# EAGLE design power_pcb (EAGLE 9.0.0)
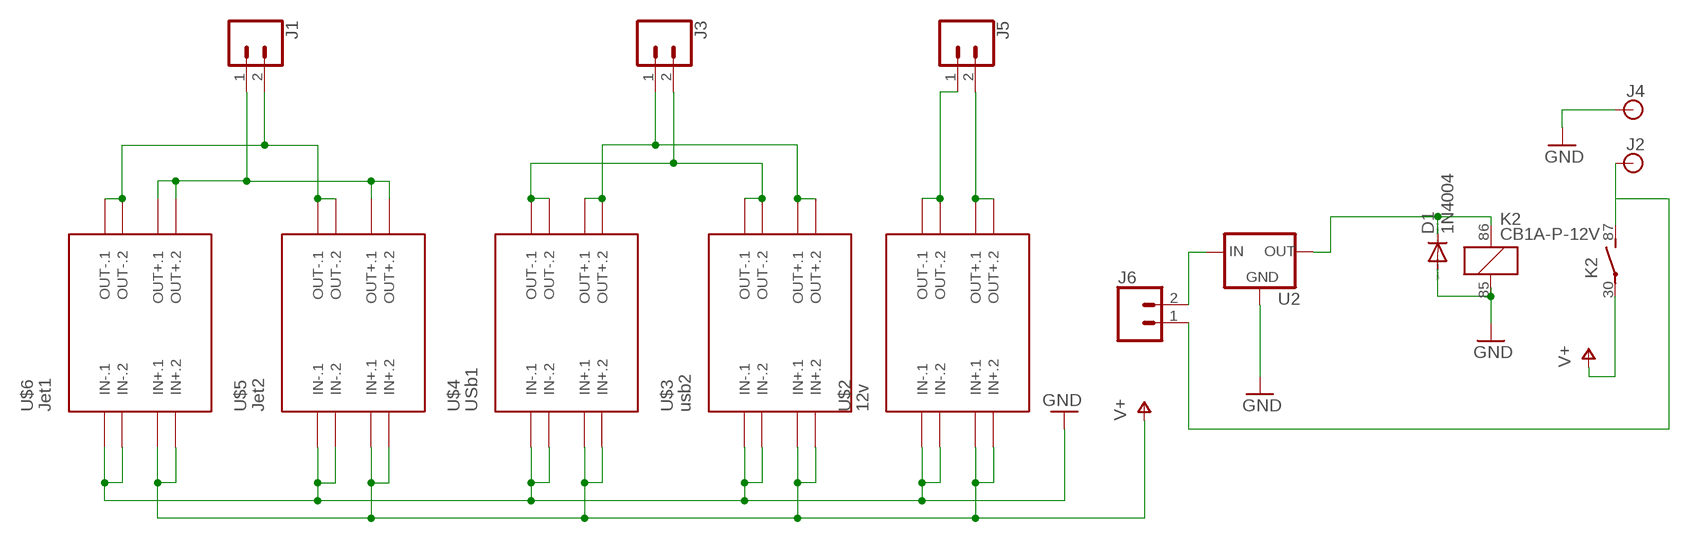
[diagram p0: schematic, sheet 1]

## Parts
D1  1N4004  [DO41-10]
J1  CONN_025MM  [SCREWTERMINAL-5MM-2]
J2  BANANA_CONN  [BANANA_CONN]
J3  CONN_025MM  [SCREWTERMINAL-5MM-2]
J4  BANANA_CONN  [BANANA_CONN]
J5  CONN_025MM  [SCREWTERMINAL-5MM-2]
J6  CONN_025MM  [SCREWTERMINAL-5MM-2]
K2  CB1A-P-12V  [CB1]
U2  V_REG_78XXSINK  [TO220-IGO]
U$2  12v  DC-DC-STEP-DOWN-MP1584  [DC-DC-STEP-DOWN-MP1584]
U$3  usb2  DC-DC-STEP-DOWN-MP1584  [DC-DC-STEP-DOWN-MP1584]
U$4  USb1  DC-DC-STEP-DOWN-MP1584  [DC-DC-STEP-DOWN-MP1584]
U$5  Jet2  DC-DC-STEP-DOWN-MP1584  [DC-DC-STEP-DOWN-MP1584]
U$6  Jet1  DC-DC-STEP-DOWN-MP1584  [DC-DC-STEP-DOWN-MP1584]

## Nets
GND: D1.A J4.P$1 K2.85 U2.GND U$2.IN-.1 U$2.IN-.2 U$3.IN-.1 U$3.IN-.2 U$4.IN-.1 U$4.IN-.2 U$5.IN-.1 U$5.IN-.2 U$6.IN-.1 U$6.IN-.2
N$2: J2.P$1 J6.1 K2.87(2:S)
N$4: J1.1 U$5.OUT+.1 U$5.OUT+.2 U$6.OUT+.1 U$6.OUT+.2
N$5: J1.2 U$5.OUT-.1 U$5.OUT-.2 U$6.OUT-.1 U$6.OUT-.2
N$6: J3.2 U$3.OUT-.1 U$3.OUT-.2 U$4.OUT-.1 U$4.OUT-.2
N$7: J3.1 U$3.OUT+.1 U$3.OUT+.2 U$4.OUT+.1 U$4.OUT+.2
N$8: J5.1 U$2.OUT-.1 U$2.OUT-.2
N$9: J5.2 U$2.OUT+.1 U$2.OUT+.2
N$11: D1.C K2.86 U2.OUT
N$13: J6.2 U2.IN
V+: K2.30(2:P) U$2.IN+.1 U$2.IN+.2 U$3.IN+.1 U$3.IN+.2 U$4.IN+.1 U$4.IN+.2 U$5.IN+.1 U$5.IN+.2 U$6.IN+.1 U$6.IN+.2

## Library data of the parts
D1 = diode:1N4004: DIODE general purpose rectifier, 1 A
J1 J3 J5 J6 = SparkFun-Connectors:CONN_02: Multi connection point. Often used as Generic Header-pin footprint for 0.1 inch spaced/style header connections On any of the 0.1 inch spaced packages, you can populate with these: Break Away Headers - Straight <https://www.sparkfun.com/products/116> (PRT-00116) Break Away Male Headers - Right Angle <https://www.sparkfun.com/products/553> (PRT-00553) Female Headers <https://www.sparkfun.com/products/115> (PRT-00115) Break Away Headers - Machine Pin <https://www.sparkfun.com/products/117> (PRT-00117) Break Away Female Headers - Swiss Machine Pin <https://www.sparkfun.com/products/743> (PRT-00743) For SCREWTERMINALS and SPRING TERMINALS visit here: Screw Terimnals on SparkFun.com <https://www.sparkfun.com/search/results?term=Screw+Terminals> (5mm/3.5mm/2.54mm spacing) This device is also useful as a general connection point to wire up your design to another part of your project. Our various solder wires solder well into these plated through hole pads. Hook-Up Wire - Assortment (Stranded, 22 AWG) <https://www.sparkfun.com/products/11375> (PRT-11375) Hook-Up Wire - Assortment (Solid Core, 22 AWG) <https://www.sparkfun.com/products/11367> (PRT-11367) View the entire wire category on our website here <https://www.sparkfun.com/categories/141> Special notes: Molex polarized connector foot print use with: PRT-08233 with associated crimp pins and housings. 2.54_SCREWTERM for use with PRT-10571. 3.5mm Screw Terminal footprints for PRT-08084 5mm Screw Terminal footprints for use with PRT-08432; SF_SKU: PRT-08432
J2 J4 = SparkFun-Connectors:BANANA_CONN: Through-hole Banana Jack Basic PTH connection for banana jack plugs SparkFun Products: Multimeter Kit <https://www.sparkfun.com/products/retired/10956> Banana to Alligator Cable <https://www.sparkfun.com/products/retired/509> Banana to Alligator Coax Cable <https://www.sparkfun.com/products/retired/508> Banana to Banana Cable <https://www.sparkfun.com/products/retired/507> Banana to IC Hook Cables <https://www.sparkfun.com/products/retired/506>
K2 = relay:CB*: HIGH POWER AUTOMOTIVE RELAY Form A NAiS Source: http://www.mew-europe.com/.. en_ds_61202_0000.pdf; MF: AROMAT/ MATSUSHITA; MPN: CB1A-P-12V; OC_FARNELL: 1270582; OC_NEWARK: 50B849
U2 = SparkFun-IC-Power:V_REG_78XX: Voltage Regulator Standard 78xx regulator. IGO (Input Ground Output). Spark Fun Electronics SKU : COM-00107
U$2-U$6 = diy-modules:DC-DC-STEP-DOWN-MP1584: DC/DC Step-Down Regulator based on MP1584 chip MP1584 datasheet available here: http://www.haoyuelectronics.com/Attachment/MP1584/MP1584.pdf Click here to find device on ebay.com <http://www.ebay.com/sch/mp1584+module>

## Board
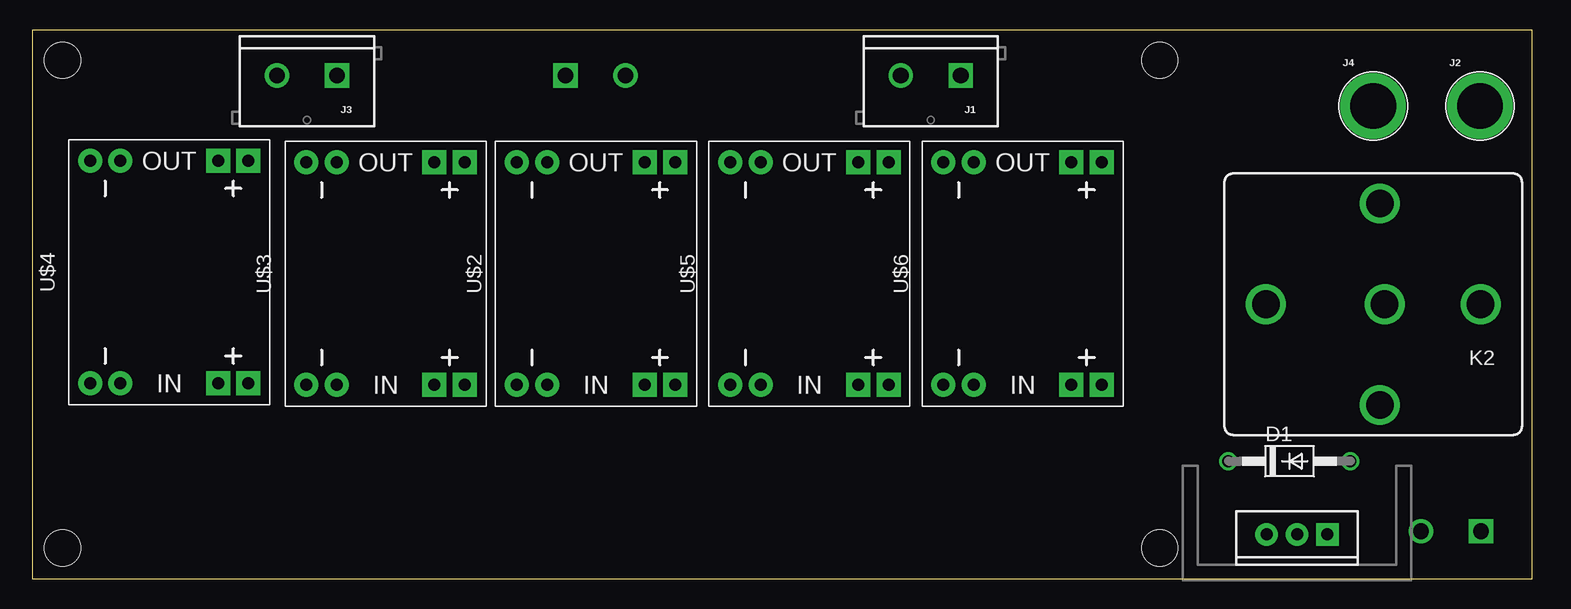
[diagram p1: board, top side]
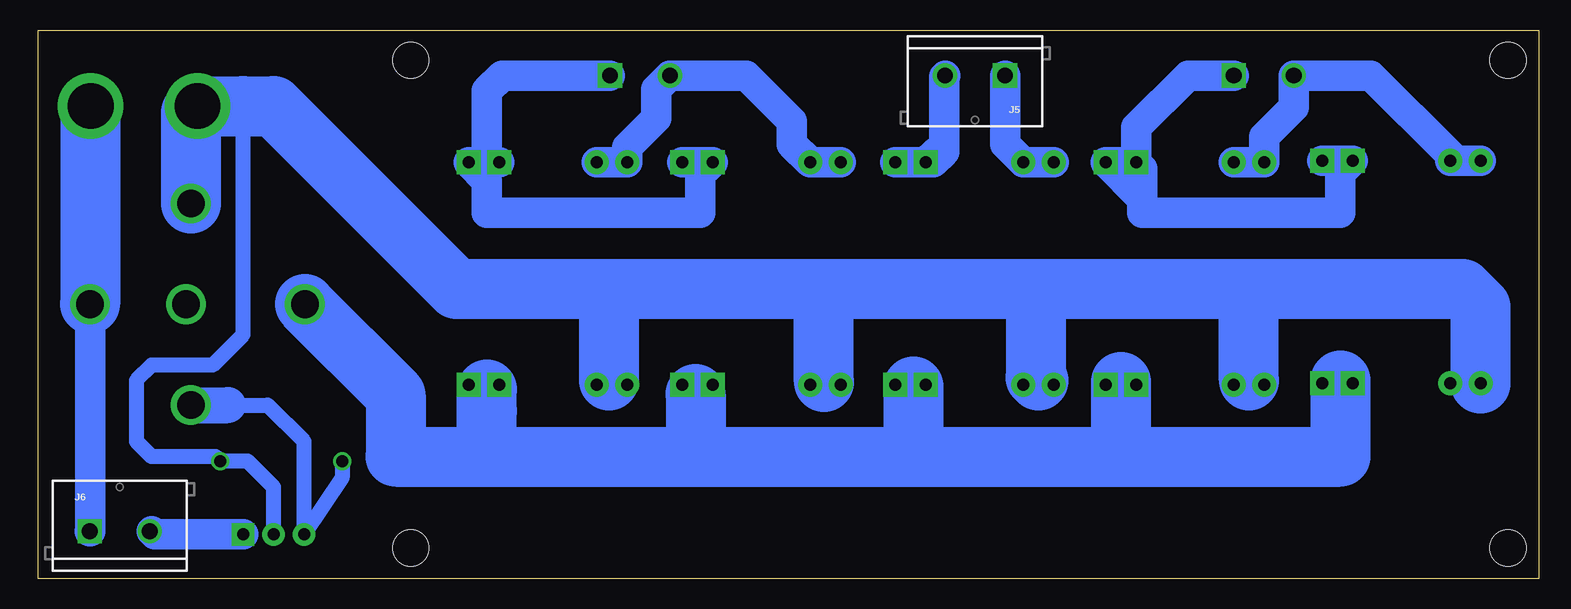
[diagram p2: board, bottom side, seen from below]

Size 125.02 x 45.71 mm. Coordinates in mm from the lower left corner, seen from the top.
Outline: 0,0 125.02,0 125.02,45.71 0,45.71 0,0
Copper layers (1*16): Top 0.035mm / dielectric 1.5mm / Bottom 0.035mm
Design rules "default": minimum track width 6mil, minimum drill 0.35mm, track to track 6mil, track to pad 6mil, pad to pad 6mil, via to via 6mil, smd to smd 6mil, copper to edge 40mil, drill to drill 6mil, minimum pad ring 10mil, minimum via ring 8mil, stop-mask expansion 4mil, vias tented up to drill 0mil, thermal gap 10mil
Holes 3 mm at 2.54,43.18 2.54,2.54 93.98,2.54 93.98,43.18

### Footprints (pad centres in the part's own frame; a part is rotated, then mirrored left to right if it is on the bottom)
DO41-10 = drill 1: A 5.08,0; C -5.08,0
SCREWTERMINAL-5MM-2 = drill 1.3 pad 2.032 square: 1 0,0 | drill 1.3 pad 2.032: 2 5,0
BANANA_CONN = drill 3.81 pad 5.461: P$1 0,0
CB1 = drill 2.3: 30 8.95,0; 85 -0.55,-8.4; 86 -0.55,8.4; 87 -8.95,0; 87A -0.95,0
TO220-IGO = drill 1 pad 1.88: GND 0,0; OUT 2.54,0 | drill 1 pad 1.88 square: IN -2.54,0
DC-DC-STEP-DOWN-MP1584 = drill 1 pad 2 square: IN+.1 -9.271,-4.064; IN+.2 -9.271,-6.604; OUT+.1 9.271,-4.064; OUT+.2 9.271,-6.604 | drill 1 pad 2: IN-.1 -9.271,6.604; IN-.2 -9.271,4.064; OUT-.1 9.271,6.604; OUT-.2 9.271,4.064

### Placement (x,y rotation side)
D1  104.78,9.78 0 top
J1  77.39,41.91 180 top
J2  120.65,39.37 0 top
J3  25.4,41.91 180 top
J4  111.76,39.37 0 top
J5  44.45,41.91 180 bottom
J6  120.73,3.94 0 bottom
K2  111.76,22.86 180 top
U2  105.41,3.68 180 top
U$2  46.99,25.4 90 top
U$3  29.46,25.4 90 top
U$4  11.43,25.53 90 top
U$5  64.77,25.4 90 top
U$6  82.55,25.4 90 top

### Tracks (layer width: path | path; a pad name or v marks a point on that pad's centre or on a via)
GND
  Bottom 1.27: 102.36,37.21 102.36,36.7 102.55,36.51 | U$3.IN-.2 24.51,16.13 24.13,16.51 23.75,16.13 U$3.IN-.1 | U$4.IN-.2 6.6,16.26 | 6.6,16.26 6.35,16.51 | U$4.IN-.1 6.6,16.26 | U$2.IN-.1 41.02,16.76 41.91,16.76 42.29,16.76 U$2.IN-.2 | U$5.IN-.1 58.42,16.38 59.56,16.38 60.45,16.38 U$5.IN-.2 | U$6.IN-.1 76.2,16.38 76.2,17.78 76.84,17.78 U$6.IN-.2 | U$6.IN-.2 78.74,16.38 78.74,17.78 | U$6.IN-.2 78.49,16.76 77.47,17.78 | U2.GND 105.41,7.62 107.57,9.78 D1.A 110.24,10.16 115.57,10.16 116.84,11.43 116.84,16.51 115.57,17.78 110.49,17.78 107.95,20.32 107.95,39.37
  Bottom 5: U$4.IN-.1 4.83,22.61 6.35,24.13 24.13,24.13 | 77.47,24.13 90.17,24.13 102.55,36.51 105.41,39.37 107.95,39.37 J4.P$1 112.31,38.82 K2.85 | 77.47,24.13 58.42,24.13 | 58.42,24.13 41.91,24.13 | 41.91,24.13 24.13,24.13 | 77.47,24.13 77.47,17.78 77.47,16.51 | 58.42,24.13 59.56,22.99 59.56,16.38 | 41.91,24.13 41.91,16.76 41.66,16.51 | 24.13,16.51 24.13,24.13
N$2
  Bottom 2.54: K2.87 120.71,3.96 J6.1
  Bottom 5: J2.P$1 120.71,39.31 K2.87
N$4
  Bottom 2.54: U$5.OUT+.2 U$5.OUT+.1 69.22,34.29 69.85,34.29 69.85,30.48 87.63,30.48 87.63,33.15 U$6.OUT+.2 87.63,34.67 | U$6.OUT+.1 87.63,34.67 | J1.1 86.36,41.91 87.63,40.64 87.63,34.67
N$5
  Bottom 2.54: U$5.OUT-.1 U$5.OUT-.2 62.23,36.2 62.23,38.1 66.04,41.91 J1.2 73.53,40.77 73.53,38.35 75.95,35.94 U$6.OUT-.1 U$6.OUT-.2
N$6
  Bottom 2.54: U$3.OUT-.2 U$3.OUT-.1 22.86,36.83 20.4,39.29 J3.2 13.97,41.91 7.37,35.31 U$4.OUT-.2 U$4.OUT-.1
N$7
  Bottom 2.54: U$4.OUT+.2 U$4.OUT+.1 16.51,33.78 16.51,30.48 33.02,30.48 33.02,31.75 | U$3.OUT+.1 U$3.OUT+.2 33.15,31.75 33.02,31.75 | J3.1 29.21,41.91 33.53,37.59 U$3.OUT+.1 | U$3.OUT+.1 33.02,34.16 33.02,31.75
N$8
  Bottom 2.54: U$2.OUT-.1 U$2.OUT-.2 44.45,36.2 J5.1
N$9
  Bottom 2.54: J5.2 49.53,41.83 49.53,35.56 | 49.53,35.56 50.42,34.67 U$2.OUT+.2 | U$2.OUT+.1 50.16,35.56 49.53,35.56
N$11
  Bottom 1.27: D1.C 99.7,8.38 U2.OUT 102.87,11.43 105.9,14.46 109.22,14.46
  Bottom 3: K2.86 109.22,14.46
N$13
  Bottom 1.27: 115.57,3.94 J6.2
  Bottom 2.54: U2.IN 115.32,3.68 115.57,3.94
V+
  Bottom 1.27: U$4.IN+.1 16.26,16.26 16.51,16.51 16.76,16.26 U$4.IN+.2 | U$5.IN+.1 69.47,16.13 70.23,15.37 70.99,16.13 U$5.IN+.2 | U$2.IN+.2 52.7,15.24 52.07,15.24 51.94,15.24 U$2.IN+.1 | U$3.IN+.1 34.54,16.13 34.8,16.38 35.56,15.62 35.56,15.24 | U$3.IN+.2 36.07,15.75 35.56,15.24 | 35.56,15.24 35.56,13.97 | U$6.IN+.2 89.15,15.49 87.63,13.97 87.63,15.11 U$6.IN+.1
  Bottom 5: K2.30 95.25,15.3 95.25,10.16 87.63,10.16 | 87.63,10.16 69.85,10.16 | 69.85,10.16 52.07,10.16 | 52.07,10.16 34.29,10.16 | 34.29,10.16 16.51,10.16 16.51,16.51 | 34.29,10.16 34.8,10.67 34.8,16.38 | 52.07,10.16 52.07,15.24 52.07,16 | 69.85,10.16 70.23,10.54 70.23,15.37 | 87.63,10.16 87.63,13.97 87.63,15.75